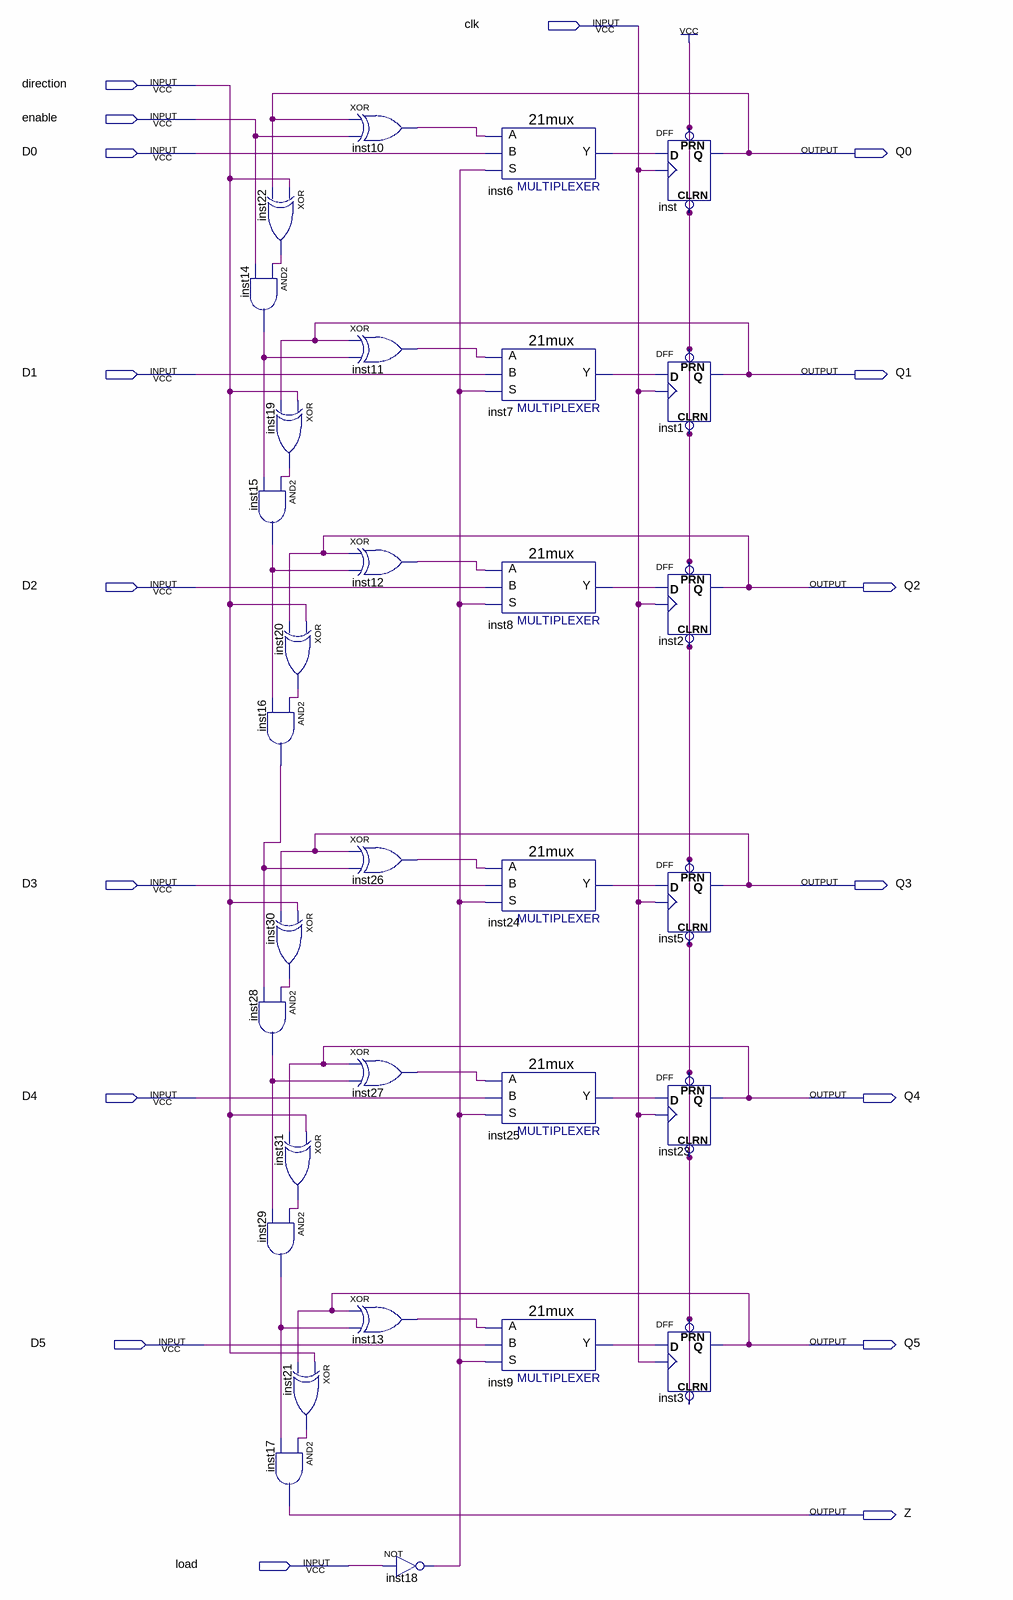
[diagram p0: schematic sheet]
// Quartus schematic 6bitUpDownCounter.bdf as structural Verilog: 31 symbols, 17 pins
module \6bitUpDownCounter  (
  input  clk,
  input  direction,
  input  enable,
  input  D0,
  input  D1,
  input  D2,
  input  D3,
  input  D4,
  input  D5,
  input  load,
  output Q0,
  output Q1,
  output Q2,
  output Q3,
  output Q4,
  output Q5,
  output Z
);

  wire inst6_y, inst7_y, inst8_y, inst9_y, inst10_out, inst11_out, inst12_out, inst13_out, inst14_out,
       inst15_out, inst16_out, inst18_out, inst19_out, inst20_out, inst21_out, inst22_out, inst24_y,
       inst25_y, inst26_out, inst27_out, inst28_out, inst29_out, inst30_out, inst31_out;

  xor inst22 (inst22_out, direction, Q0);
  and inst14 (inst14_out, inst22_out, enable);
  xor inst19 (inst19_out, direction, Q1);
  and inst15 (inst15_out, inst19_out, inst14_out);
  and inst16 (inst16_out, inst20_out, inst15_out);
  xor inst30 (inst30_out, direction, Q3);
  and inst28 (inst28_out, inst30_out, inst16_out);
  and inst29 (inst29_out, inst31_out, inst28_out);
  and inst17 (Z, inst21_out, inst29_out);
  xor inst20 (inst20_out, direction, Q2);
  xor inst31 (inst31_out, direction, Q4);
  xor inst21 (inst21_out, direction, Q5);
  xor inst10 (inst10_out, Q0, enable);
  xor inst11 (inst11_out, Q1, inst14_out);
  xor inst12 (inst12_out, Q2, inst15_out);
  xor inst26 (inst26_out, Q3, inst16_out);
  xor inst27 (inst27_out, Q4, inst28_out);
  xor inst13 (inst13_out, Q5, inst29_out);
  not inst18 (inst18_out, load);
  \21mux  inst6 (.S(inst18_out), .B(D0), .A(inst10_out), .Y(inst6_y));
  \21mux  inst7 (.S(inst18_out), .B(D1), .A(inst11_out), .Y(inst7_y));
  \21mux  inst8 (.S(inst18_out), .B(D2), .A(inst12_out), .Y(inst8_y));
  \21mux  inst24 (.S(inst18_out), .B(D3), .A(inst26_out), .Y(inst24_y));
  \21mux  inst25 (.S(inst18_out), .B(D4), .A(inst27_out), .Y(inst25_y));
  \21mux  inst9 (.S(inst18_out), .B(D5), .A(inst13_out), .Y(inst9_y));
  DFF inst (.CLRN(1'b1), .CLK(clk), .D(inst6_y), .PRN(1'b1), .Q(Q0));
  DFF inst1 (.CLRN(1'b1), .CLK(clk), .D(inst7_y), .PRN(1'b1), .Q(Q1));
  DFF inst2 (.CLRN(1'b1), .CLK(clk), .D(inst8_y), .PRN(1'b1), .Q(Q2));
  DFF inst5 (.CLRN(1'b1), .CLK(clk), .D(inst24_y), .PRN(1'b1), .Q(Q3));
  DFF inst23 (.CLRN(1'b1), .CLK(clk), .D(inst25_y), .PRN(1'b1), .Q(Q4));
  DFF inst3 (.CLRN(1'b1), .CLK(clk), .D(inst9_y), .PRN(1'b1), .Q(Q5));
endmodule
